# Altium schematic sheet DC-DC.SchDoc
size A4
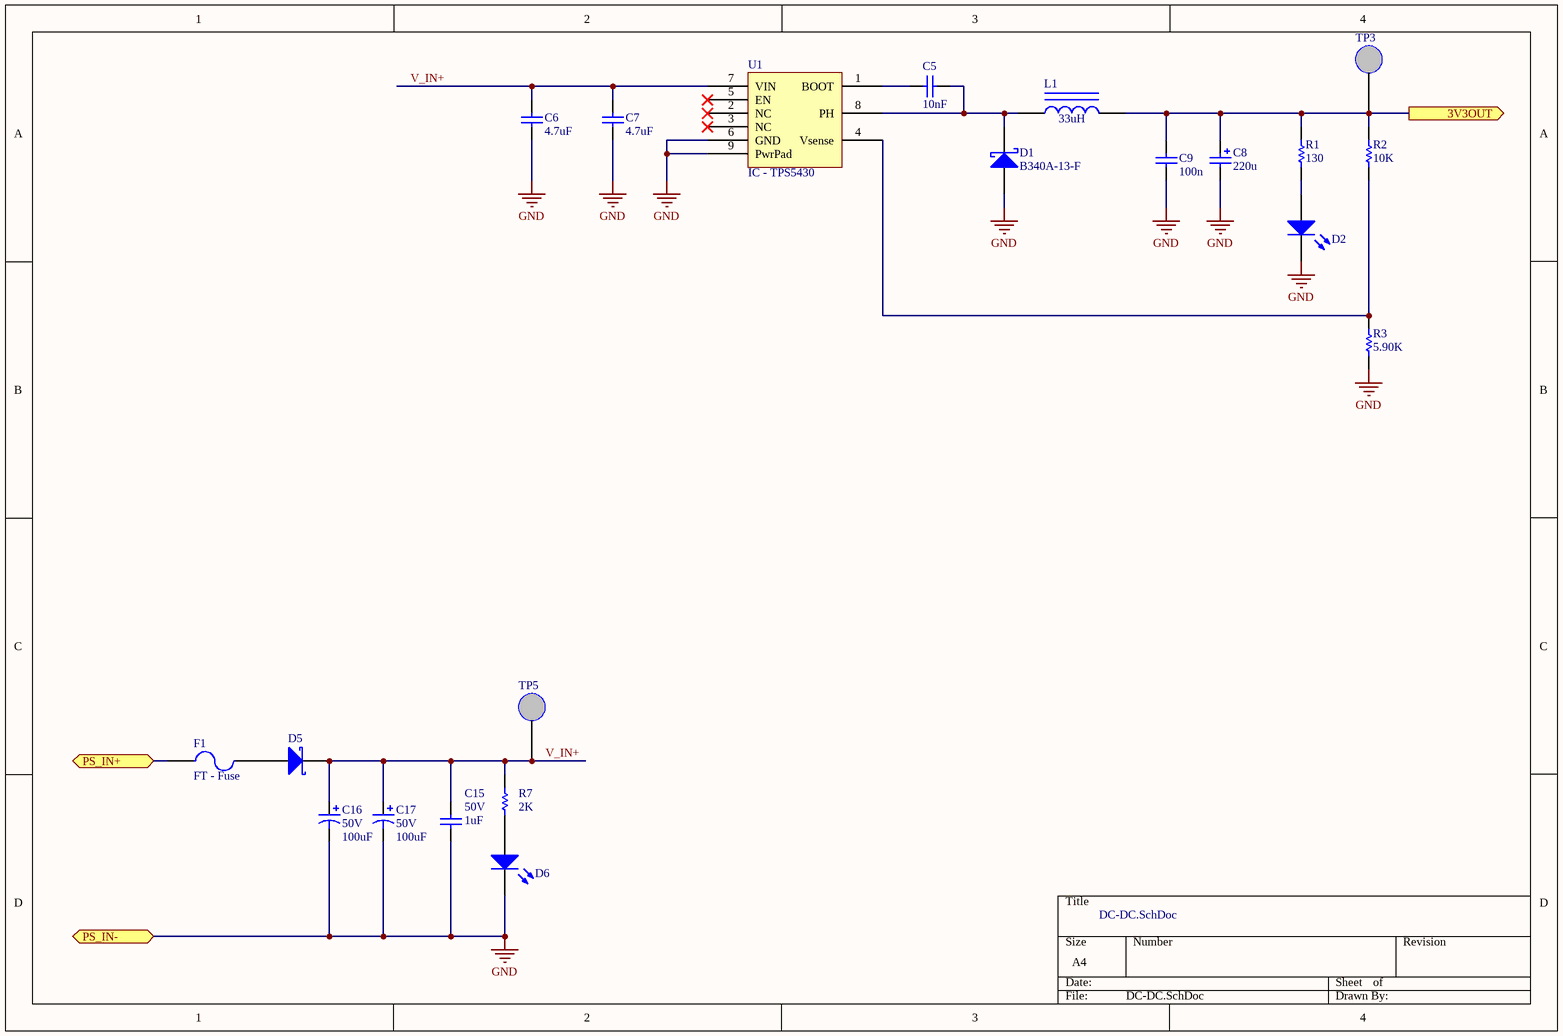
[diagram p0: DC-DC.SchDoc]

## Parts
C5  value 10nF  [CS-0603]  (hidden comment: CS - CAPACITOR)
C6  value 4.7uF  [CS-1206]  (hidden comment: CS - CAPACITOR)
C7  value 4.7uF  [CS-1206]  (hidden comment: CS - CAPACITOR)
C8  value 220u  [CS-2312]  (hidden comment: CS - CAPACITOR POL)
C9  value 100n  [CS-0603]  (hidden comment: CS - CAPACITOR)
C15  value 1uF  VOLTAGE: 50V  [CS-0603]  (hidden comment: CS - CAPACITOR)
C16  value 100uF  VOLTAGE: 50V  [CT-CAP-ALUM-8X14]  (hidden comment: CT - CAPACITOR ELECTROLYTIC)
C17  value 100uF  VOLTAGE: 50V  [CT-CAP-ALUM-8X14]  (hidden comment: CT - CAPACITOR ELECTROLYTIC)
D1  B340A-13-F  [DS-DO-214AC-SMA]
D2  LED - NORMAL LED  [LED-0603 YELLOW]  (value not drawn)
D5  DT - Diode  [TO-220AC]  (value not drawn)
D6  LED - NORMAL LED  [LED-0603 YELLOW]  (value not drawn)
F1  FT - Fuse  [FT - 5mm x 20mm]
L1  value 33uH  [LS-Inductor SMD]  (hidden comment: LS - INDUCTOR)
R1  value 130  [RS-0603]  (hidden comment: RS - RESISTOR)
R2  value 10K  [RS-0603]  (hidden comment: RS - RESISTOR)
R3  value 5.90K  [RS-0603]  (hidden comment: RS - RESISTOR)
R7  value 2K  [RS-0603]  (hidden comment: RS - RESISTOR)
TP3  5003K  [TP - VERTICAL]  (value not drawn)
TP5  5003K  [TP - VERTICAL]  (value not drawn)
U1  IC - TPS5430  [IC-SOIC8-POWERPAD]

## Ports
3V3OUT (out), PS_IN+, PS_IN-

## Nets
GND: C6.1 C7.1 C8.2 C9.1 C15.1 C16.2 C17.2 D1.A D2.K D6.K R3.2 U1.6(GND) U1.9(PwrPad) ; port PS_IN-
3V3OUT: C8.1 C9.2 L1.2 R1.1 R2.1 TP3.1 ; port 3V3OUT
PS_IN+: F1.1 ; port PS_IN+
V_IN+: C6.2 C7.2 C15.2 C16.1 C17.1 D5.1(K) R7.2 TP5.1 U1.7(VIN)
NetC5_1: C5.1 D1.K L1.1 U1.8(PH)
NetC5_2: C5.2 U1.1(BOOT)
NetD2_A: D2.A R1.2
NetD5_3: D5.3(A) F1.2
NetD6_A: D6.A R7.1
NetR2_2: R2.2 R3.1 U1.4(Vsense)

Not connected (* = marked no-connect by the designer): U1 2(NC)* 3(NC)* 5(EN)*

## Library data of the parts
C5 = CS - CAPACITOR: CAP CER 10000PF 50V 10% X7R 0603; Manufacturer: TDK; (FIELD A): tantalum; VOLTAGE: 16V; Supplier 1: Digikey; Supplier Part Number 1: 445-1311-1-ND; (FLIED C): *; (FIELD B): *; TOLERANCE: 10%
C6 C7 = CS - CAPACITOR: Manufacturer: Samsung; TOLERANCE: 10%; VOLTAGE: 16V; Supplier 1: Digikey; Supplier Part Number 1: 1276-1292-1-ND; (FIELD A): *; (FLIED C): *; (FIELD B): *
C8 = CS - CAPACITOR POL: TOLERANCE: 10%; Supplier 1: *; Supplier Part Number 1: *; (FIELD A): *; (FLIED C): *; (FIELD B): *; Manufacturer: *; VOLTAGE: VOLTAGE; Supplier 2: Digi-Key; Supplier Part Number 2: 478-5236-1-ND
C9 = CS - CAPACITOR: TOLERANCE: 10%; VOLTAGE: 16V; Supplier 1: *; Supplier Part Number 1: 490-1532-1-ND; (FIELD A): *; (FLIED C): *; (FIELD B): *; Manufacturer: *
C15 = CS - CAPACITOR: TOLERANCE: 10%; Supplier 1: *; Supplier Part Number 1: *; (FIELD A): *; (FLIED C): *; (FIELD B): *; Manufacturer: *
C16 C17 = CT - CAPACITOR ELECTROLYTIC: TOLERANCE: 10%; Supplier 1: *; Supplier Part Number 1: *; (FIELD A): *; (FLIED C): *; (FIELD B): *; Manufacturer: *
D1 = DS - Schottky: DIODE SCHOTTKY 40V 3A SMA; Manufacturer: Diodes Incorporated; Supplier Part Number 1: B340A-FDICT-ND; Supplier 1: Digikey; FORWARS VOLTAGE: *; (FIELD A): *; (FIELD B): *; (FIELD C): *; Supplier 2: Digi-Key; Supplier Part Number 2: B340A-FDICT-ND
D5 = Diode 18TQ045: Zener Schottky; Supplier 1: *; Supplier 2: Digi-Key; FORWARD VOLTAGE: *; Supplier Part Number 2: MBR1645-E3/45GI-ND; Supplier Part Number 1: *; (FIELD A): *; (FIELD B): *; (FIELD C): *; CURRENT MAX: *
F1 = FT - Fuse: Manufacturer: Schurter Inc; Supplier 1: Digikey; Supplier Part Number 1: 486-1259-ND
L1 = LS - INDUCTOR: INDUCTOR SHIELD PWR; Manufacturer: Bourns Inc; CURRENT: 2.8A; IMAX: 3A; (FIELD A): *; (FIELD B): *; (FIELD C): *; RESISTOR: *; Supplier 1: Digikey; Supplier Part Number 1: SRR1260-330M
R1-R3 = RS - RESISTOR: TOLERANCE: RES TOL; POWER: RES POWER; Supplier Part Number 1: *; Supplier 1: *; (FIELD A): *; (FLIED C): *; (FIELD B): *; Manufacturer: *
R7 = RS - RESISTOR: TOLERANCE: RES TOL; POWER: 1/10W; Supplier Part Number 1: *; Supplier 1: *; (FIELD A): *; (FLIED C): *; (FIELD B): *; Manufacturer: *
TP3 TP5 = TP - Test point vertical: (FIELD A): *; (FIELD B): *; (FIELD C): *; Manufacturer: *; Supplier 1: Newark; Supplier Part Number 1: 62W5140
U1 = IC - TPS5430: IC REG BUCK ADJ 3A 8SOPWRPAD; Manufacturer: Texas Instruments; Part Number: TPS5430; Supplier 1: Digi-Key; Supplier Part Number 1: 296-26988-1-ND
D2 D6 = LED - NORMAL LED: FORWARS VOLTAGE: *; CURRENT: *; COLOR: *; Supplier Part Number 1: *; Supplier 1: *; (FIELD B): *; (FIELD A): *; (FIELD C): *; Manufacturer: *